# EasyEDA Pro project 二版平衡车pcb.epro, board PCB_PCB_STM32F1-HC05-board_2024-06-19
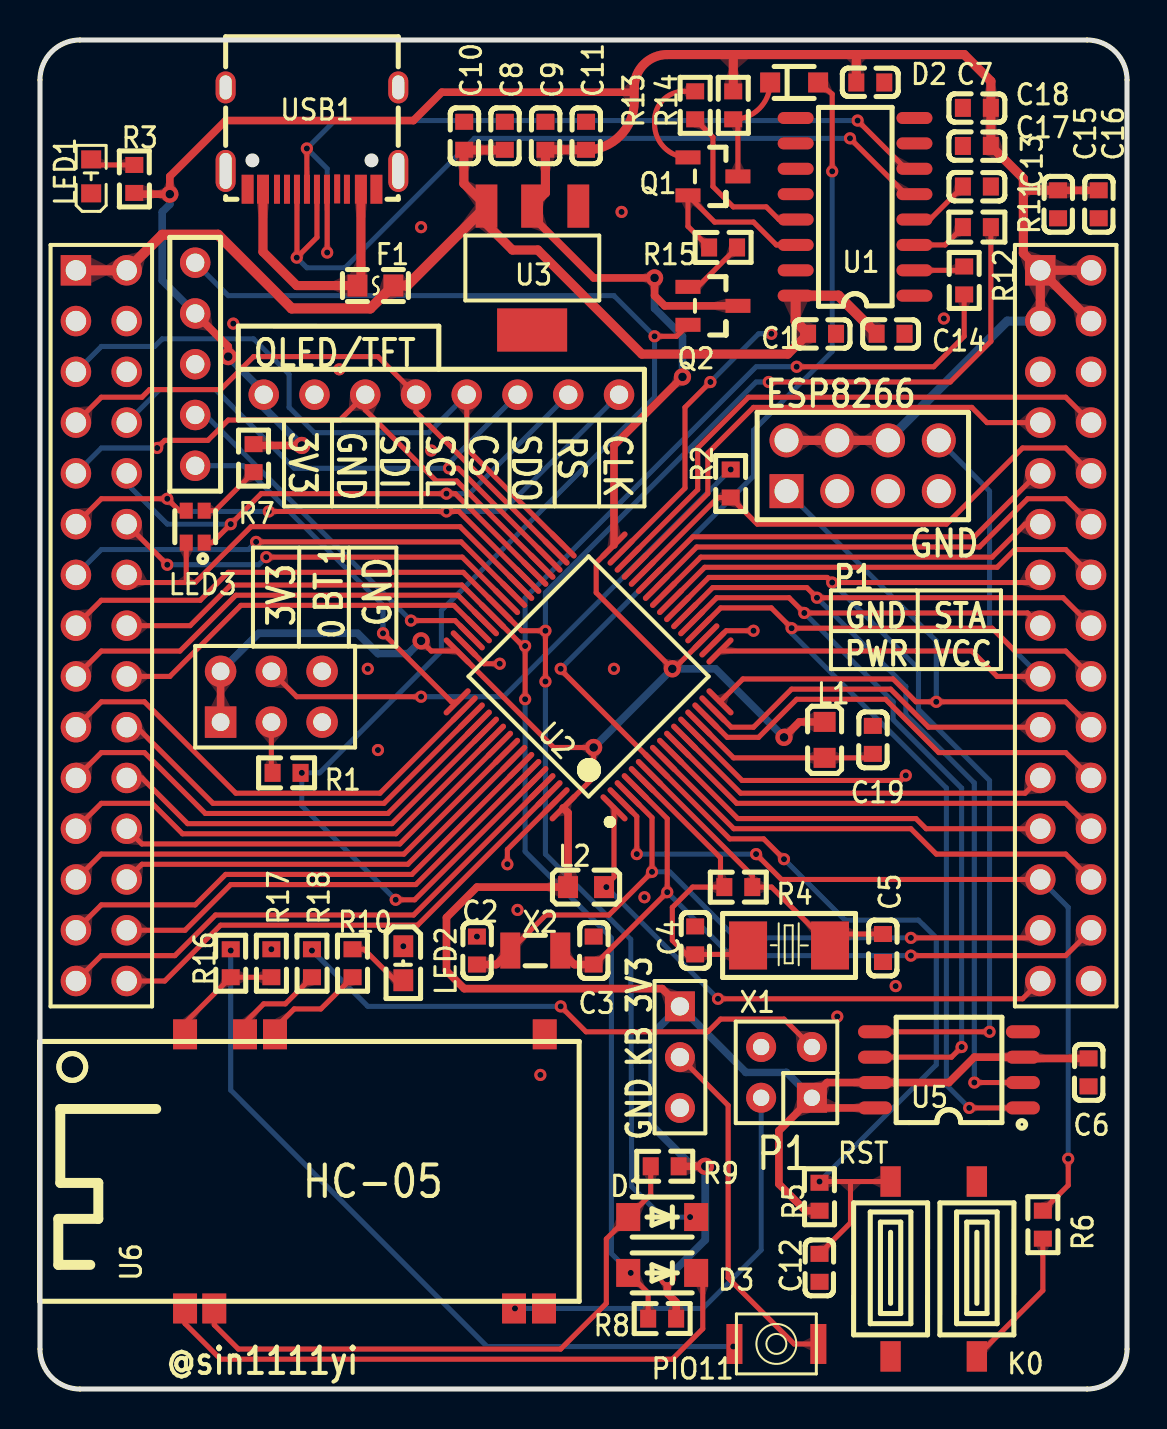
[diagram p10: board, top side]
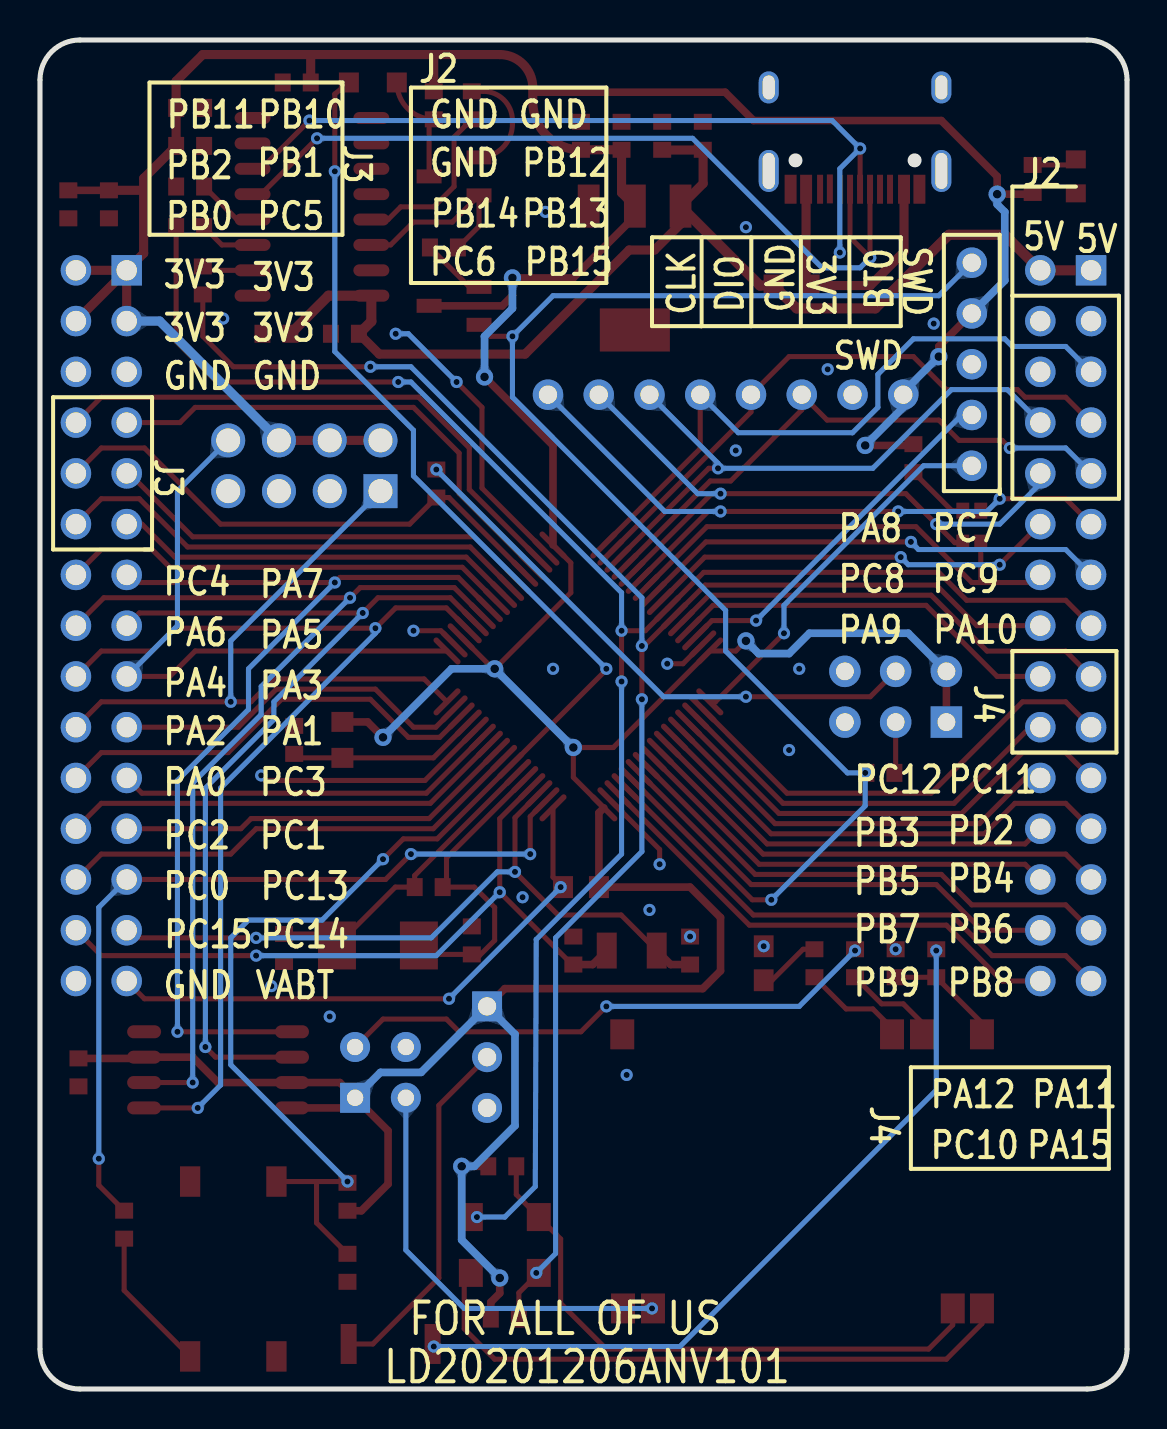
[diagram p11: board, bottom side, seen from below]

Outline 54.4 x 67.5 mm; copper layers: Top Layer, Bottom Layer. Coordinates in mm from the lower left corner of the outline.
Outline path: 0,65.5 0,2 arc(0.59,0.59) 2,0 52.4,0 arc(53.81,0.59) 54.4,2 54.4,65.5 arc(53.81,66.91) 52.4,67.5 2,67.5 arc(0.59,66.91) 0,65.5
Stack: Top Layer 0.035mm / Dielectric1 1.51mm FR4 er 4.5 / Bottom Layer 0.035mm

## Design rules (mm)
spacing Default (default): track to track 0.152, other pairs 0 to 0.152
track width Default (default): min 0.254, default 0.254, max 25.4
differential pair differentialPair (default): width min 0.127, default 0.254, max 2.54; gap min 0.152, default 0.152
via Default (default): diameter min 0.61, default 0.61, max 100.025; hole min 0.305, default 0.305, max 59.995
net GND uses gge23379
pour e256 uses gge23398
pour e1256 uses gge23379

## Placement (name value [footprint] x y rotation side)
1  -  [HEADER5*1]  7.77 51.28 270 top
C1  10uF  [C0603]  39.14 52.8 180 top
C2  12pF  [C0603]  21.87 21.94 270 top
C3  12pF  [C0603]  27.71 21.94 270 top
C4  22pF  [C0603]  32.79 22.45 270 top
C5  22pF  [C0603]  42.19 22.07 90 top
C6  100nF  [C0603]  52.47 15.84 270 top
C7  100nF  [C0603]  41.55 65.37 0 top
C8  10uF  [C0603]  23.26 62.71 270 top
C9  10uF  [C0603]  25.3 62.71 270 top
C10  100nF  [C0603]  21.23 62.71 270 top
C11  100nF  [C0603]  27.33 62.71 270 top
C12  10uF  [C0603]  39.01 6.06 90 top
C13  1nF  [C0603]  46.89 60.17 180 top
C14  100nF  [C0603]  42.57 52.8 180 top
C15  100nF  [C0603]  50.95 59.28 270 top
C16  100nF  [C0603]  52.98 59.28 270 top
C17  100nF  [C0603]  46.89 62.2 180 top
C18  100nF  [C0603]  46.89 64.1 180 top
C19  100nF  [C0603]  41.68 32.48 270 top
D1  MBR0540T1G  [SOD-123_L2.8-W1.8-LS3.7-RD]  31.14 8.6 180 top
D2  1N4148WS T4  [SOD-323_L1.8-W1.3-LS2.5-RD]  37.74 65.37 0 top
D3  MBR0540T1G  [SOD-123_L2.8-W1.8-LS3.7-RD]  31.14 5.81 180 top
F1  ASMD0603-050  [F0603]  16.79 55.21 0 top
H1  2.54排母2.54_2x3  [HDR-3X2/2.54]  11.58 34.64 0 top
H2  Header2*4  [HEADER2*4_2.54MM]  41.17 46.2 0 top
J2  Header-Male-2.54_2x15  [HDR-TH_30P-P2.54-V-R2-C15-S2.54]  51.33 38.19 270 top
J3  Header-Male-2.54_2x15  [HDR-TH_30P-P2.54-V-R2-C15-S2.54]  3.07 38.19 270 top
J4  HEADER1*3  [HDR1X3]  32.03 16.6 270 top
K0  SWITCH-3x6x2.5_SMD  [SWITCH-3X6X2.5_SMD]  46.89 10.38 0 top
L1  SCBG160808U070T  [L0603]  39.27 32.48 270 top
L2  SCBG160808U070T  [L0603]  27.33 25.11 180 top
LED1  FC-D1608WD-460H5  [LED0603-RD]  2.56 60.67 90 top
LED2  19-217/BHC-ZL1M2RY/3T  [LED0603-R-RD]  18.18 21.3 270 top
LED3  19-237/R6GHBHC-M07/2T  [LED-ARRAY-SMD_4P-L1.6-W1.6-TR]  7.77 43.15 270 top
P1  Header 2*2  [LC-HDR2*2-2.54]  37.36 15.84 90 top
PIO11  SKRKAEE020 轻触开关3*4*2  [SKRKAEE020]  36.85 2.25 0 top
Q1  S9013 J3  [SOT-23-3_L2.9-W1.3-P1.90-LS2.4-BR]  33.68 60.67 180 top
Q2  S9013 J3  [SOT-23-3_L2.9-W1.3-P1.90-LS2.4-BR]  33.68 54.2 180 top
R1  10K  [R0603]  12.34 30.83 0 top
R2  10K  [R0603]  34.57 45.31 90 top
R3  1.21K  [R0603]  4.72 60.55 270 top
R4  1M  [R0603]  34.95 25.11 180 top
R5  10K  [R0603]  39.01 9.62 90 top
R6  10K  [R0603]  50.19 8.22 270 top
R7  510  [R0603]  10.69 46.58 90 top
R8  5.6K  [R0603]  31.14 3.52 0 top
R9  5.6K  [R0603]  31.26 11.14 0 top
R10  510  [R0603]  15.64 21.3 90 top
R11  10K  [R0603]  46.89 58.13 0 top
R12  10K  [R0603]  46.25 55.47 270 top
R13  10K  [R0603]  32.79 64.23 270 top
R14  10K  [R0603]  34.69 64.23 270 top
R15  10K  [R0603]  34.18 57.12 0 top
R16  510  [R0603]  9.55 21.3 90 top
R17  10K  [R0603]  11.58 21.3 270 top
R18  10K  [R0603]  13.61 21.3 270 top
RST  SWITCH-3x6x2.5_SMD  [SWITCH-3X6X2.5_SMD]  42.57 10.38 0 top
U1  CH340G  [SOIC-16_L9.9-W3.9-P1.27-LS6.0-BR]  40.79 59.15 0 top
U2  STM32F103RCT6  [LQFP-64_L10.0-W10.0-P0.50-LS12.0-BL]  27.45 35.65 45 top
U3  AMS1117-3.3_C165482  [SOT-223_L6.5-W3.5-P2.30-LS7.0-BR]  24.64 56.09 90 top
U4  Header8P  [排针8P]  11.2 49.75 0 top
U5  W25Q80DVSSIG  [SOIC-8_L5.3-W5.3-P1.27-LS8.0-BL]  45.49 15.97 90 top
U6  HC-05  [BTK-05]  13.48 10.89 90 top
USB1  TYPEC-304-BCP16  [USB-C-SMD_TYPEC-304-BCP16]  13.61 62.58 180 top
X1  8MHz  [OSC-SMD_L5.0-W3.2]  37.49 22.19 180 top
X2  32.768KHz  [FC-135R_L3.2-W1.5]  24.79 21.94 180 top

## Footprints (pads in the part's own frame, mm; a bottom-side part is the same pattern mirrored in y, then rotated)
BTK-05
  rect 1.5x1.2 smd: 1(-6.858,6.223) 2(-6.858,4.761) 12(-6.858,-10.239) 13(-6.858,-11.739) 22(6.858,-11.777) 31(6.858,1.723) 32(6.858,3.223) 34(6.858,6.223)
C0603
  rect 0.8x0.9 smd: 1(-0.7,0) 2(0.7,0)
F0603
  rect 1x1.1 smd: 1(-0.9,0) 2(0.9,0)
FC-135R_L3.2-W1.5
  rect 1x1.8 smd: 1(-1.25,0) 2(1.25,0)
HDR1X3
  rect 1.498x1.498 hole 0.914: 1(-2.54,0)
  round 1.498 hole 0.914: 2(0,0) 3(2.54,0)
HDR-3X2/2.54
  rect 1.575x1.575 hole 0.889: 1(-2.54,-1.27)
  round 1.575 hole 0.889: 2(-2.54,1.27) 3(0,-1.27) 4(0,1.27) 5(2.54,-1.27) 6(2.54,1.27)
HDR-TH_30P-P2.54-V-R2-C15-S2.54
  rect 1.524x1.524 hole 1.016x1.021: 1(-17.78,-1.27)
  round 1.524 hole 1.021x1.016: 2(-17.78,1.27) 3(-15.24,-1.27) 4(-15.24,1.27) 5(-12.7,-1.27) 6(-12.7,1.27) 7(-10.16,-1.27) 8(-10.16,1.27) 9(-7.62,-1.27) 10(-7.62,1.27) 11(-5.08,-1.27) 12(-5.08,1.27) 13(-2.54,-1.27) 14(-2.54,1.27) 15(0,-1.27) 16(0,1.27) 17(2.54,-1.27) 18(2.54,1.27) 19(5.08,-1.27) 20(5.08,1.27) 21(7.62,-1.27) 22(7.62,1.27) 23(10.16,-1.27) 24(10.16,1.27) 25(12.7,-1.27) 26(12.7,1.27) 27(15.24,-1.27) 28(15.24,1.27) 29(17.78,-1.27) 30(17.78,1.27)
HEADER2*4_2.54MM
  rect 1.7x1.7 hole 1.2: 1(-3.81,-1.27)
  round 1.7 hole 1.2: 2(-3.81,1.27) 3(-1.27,-1.27) 4(-1.27,1.27) 5(1.27,-1.27) 6(1.27,1.27) 7(3.81,-1.27) 8(3.81,1.27)
HEADER5*1
  round 1.524 hole 0.914: 1(-5.08,0) 2(-2.54,0) 3(0,0) 4(2.54,0) 5(5.08,0)
L0603
  rect 1x1.1 smd: 1(-0.9,0) 2(0.9,0)
LC-HDR2*2-2.54
  rect 1.5x1.5 hole 0.818x0.813: 1(-1.27,-1.27)
  round 1.5 hole 0.818x0.813: 2(-1.27,1.27) 3(1.27,-1.27) 4(1.27,1.27)
LED0603-R-RD
  rect 1.092x0.991 smd: 1(0.851,0) 2(-0.851,0)
LED0603-RD
  rect 0.9x1 smd: 1(-0.85,0) 2(0.85,0)
LED-ARRAY-SMD_4P-L1.6-W1.6-TR
  rect 0.8x0.65 smd: 1(0.8,0.45) 2(-0.8,0.45) 3(-0.8,-0.45) 4(0.8,-0.45)
LQFP-64_L10.0-W10.0-P0.50-LS12.0-BL
  oval 0.28x1.8 smd: 1(-3.75,-5.55) 2(-3.25,-5.55) 3(-2.75,-5.55) 4(-2.25,-5.55) 5(-1.75,-5.55) 6(-1.25,-5.55) 7(-0.75,-5.55) 8(-0.25,-5.55) 9(0.25,-5.55) 10(0.75,-5.55) 11(1.25,-5.55) 12(1.75,-5.55) 13(2.25,-5.55) 14(2.75,-5.55) 15(3.25,-5.55) 16(3.75,-5.55) 33(3.75,5.55) 34(3.25,5.55) 35(2.75,5.55) 36(2.25,5.55) 37(1.75,5.55) 38(1.25,5.55) 39(0.75,5.55) 40(0.25,5.55) 41(-0.25,5.55) 42(-0.75,5.55) 43(-1.25,5.55) 44(-1.75,5.55) 45(-2.25,5.55) 46(-2.75,5.55) 47(-3.25,5.55) 48(-3.75,5.55)
  oval 1.8x0.28 smd: 17(5.55,-3.75) 18(5.55,-3.25) 19(5.55,-2.75) 20(5.55,-2.25) 21(5.55,-1.75) 22(5.55,-1.25) 23(5.55,-0.75) 24(5.55,-0.25) 25(5.55,0.25) 26(5.55,0.75) 27(5.55,1.25) 28(5.55,1.75) 29(5.55,2.25) 30(5.55,2.75) 31(5.55,3.25) 32(5.55,3.75) 49(-5.55,3.75) 50(-5.55,3.25) 51(-5.55,2.75) 52(-5.55,2.25) 53(-5.55,1.75) 54(-5.55,1.25) 55(-5.55,0.75) 56(-5.55,0.25) 57(-5.55,-0.25) 58(-5.55,-0.75) 59(-5.55,-1.25) 60(-5.55,-1.75) 61(-5.55,-2.25) 62(-5.55,-2.75) 63(-5.55,-3.25) 64(-5.55,-3.75)
OSC-SMD_L5.0-W3.2
  rect 1.9x2.4 smd: 1(-2.05,0) 2(2.05,0)
R0603
  rect 0.8x0.9 smd: 1(-0.7,0) 2(0.7,0)
SKRKAEE020
  rect 0.8x2 smd: 1(-2.1,0) 2(2.1,0)
SOD-123_L2.8-W1.8-LS3.7-RD
  rect 1.2x1.4 smd: 1(-1.7,0) 2(1.7,0)
SOD-323_L1.8-W1.3-LS2.5-RD
  rect 1x1 smd: 1(-1.2,0) 2(1.2,0)
SOIC-8_L5.3-W5.3-P1.27-LS8.0-BL
  oval 0.65x1.7 smd: 1(-1.905,-3.7) 2(-0.635,-3.7) 3(0.635,-3.7) 4(1.905,-3.7) 5(1.905,3.7) 6(0.635,3.7) 7(-0.635,3.7) 8(-1.905,3.7)
SOIC-16_L9.9-W3.9-P1.27-LS6.0-BR
  oval 1.8x0.6 smd: 1(2.972,-4.445) 2(2.972,-3.175) 3(2.972,-1.905) 4(2.972,-0.635) 5(2.972,0.635) 6(2.972,1.905) 7(2.972,3.175) 8(2.972,4.445) 9(-2.972,4.445) 10(-2.972,3.175) 11(-2.972,1.905) 12(-2.972,0.635) 13(-2.972,-0.635) 14(-2.972,-1.905) 15(-2.972,-3.175) 16(-2.972,-4.445)
SOT-23-3_L2.9-W1.3-P1.90-LS2.4-BR
  rect 1.25x0.7 smd: 1(1.25,-0.95) 2(1.25,0.95) 3(-1.25,0)
SOT-223_L6.5-W3.5-P2.30-LS7.0-BR
  rect 2.159x1.092 smd: 1(3.099,-2.299) 2(3.099,0.013) 3(3.099,2.299)
  rect 2.159x3.505 smd: 4(-3.099,0.013)
SWITCH-3X6X2.5_SMD
  rect 1.016x1.524 smd: 1(0,0) 2(0,-8.75)
USB-C-SMD_TYPEC-304-BCP16
  oval 1x2.1 hole 0.6x1.8: 13(-4.32,1.633) 14(4.32,1.633)
  oval 1x1.6 hole 0.6x1.2: 15(-4.32,-2.547) 16(4.32,-2.547)
  rect 0.6x1.45 smd: A1B12(-3.225,2.547) A4B9(-2.45,2.547) B1A12(3.22,2.547) B4A9(2.45,2.547)
  rect 0.3x1.45 smd: A5(-1.26,2.533) A6(-0.25,2.547) A7(0.25,2.547) A8(1.25,2.547) B5(1.75,2.547) B6(0.75,2.547) B7(-0.75,2.547) B8(-1.75,2.547)
排针8P
  round 1.524 hole 0.914: 1(0,0) 2(2.54,0) 3(5.08,0) 4(7.62,0) 5(10.16,0) 6(12.7,0) 7(15.24,0) 8(17.78,0)

## Nets
+5V: C1.2 C8.2 C10.2 C14.2 F1.2 J3.1 J3.2 U1.16 U3.3
GND: 1.3 C1.1 C2.1 C3.1 C4.1 C5.1 C6.2 C7.2 C8.1 C9.1 C10.1 C11.1 C12.1 C13.1 C14.1 C15.2 C16.2 C17.2 C18.2 C19.1 H1.5 H1.6 H2.7 J2.5 J2.6 J2.30 J3.3 J3.4 J3.6 J4.3 K0.1 LED1.1 LED2.2 P1.4 R17.1 RST.2 U1.1 U2.12 U2.18 U2.31 U2.47 U2.63 U3.1 U4.2 U5.4 U6.13 U6.22 USB1.A1B12 USB1.B1A12
VCC: 1.2 C6.1 C7.1 C9.2 C11.2 C15.1 C16.1 C17.1 C18.1 H1.1 H1.2 H2.2 H2.4 H2.6 J2.1 J2.2 J2.3 J2.4 J4.1 L1.1 L2.2 P1.1 Q2.3 R3.2 R5.1 R7.2 R8.2 R9.2 R14.1 U2.19 U2.32 U2.48 U2.64 U3.2 U4.1 U5.3 U5.7 U5.8
VDDA: C19.2 L1.2 U2.13
BLE_VCC: P1.2 U6.12
BOOT0: 1.1 Q2.2 R1.2 U2.60
CH340_D+: U1.5 USB1.A6 USB1.B6
CH340_D-: U1.6 USB1.A7 USB1.B7
H1_3: H1.3 R1.1
H1_4: H1.4 R2.2
HC05_RX: D1.2 R9.1 U6.2
HC05_TX: D3.1 U6.1
LED1_2: LED1.2 R3.1
LED3_2: LED3.2 R7.1
NRST: C12.2 D2.2 R5.2 RST.1 U2.7
OSC32_IN: C2.2 J2.27 U2.3 X2.2
OSC32_OUT: C3.2 J2.28 U2.4 X2.1
OSC_IN: C4.2 R4.2 U2.5 X1.2
OSC_OUT: C5.2 R4.1 U2.6 X1.1
PA0: J2.22 U2.14
PA1: J2.19 U2.15
PA2: H2.1 J2.20 U2.16
PA3: H2.8 J2.17 U2.17
PA4: J2.18 U2.20 U5.1
PA5: J2.15 U2.21 U5.6
PA6: J2.16 U2.22 U5.2
PA7: J2.13 U2.23 U5.5
PA8: J3.12 U2.41
PA9: D1.1 J3.15 R11.2 U2.42
PA10: D3.2 J3.16 R8.1 R12.2 U2.43
PA11: J3.17 U2.44
PA12: J3.18 U2.45
PA13: 1.4 U2.46
PA14: 1.5 U2.49
PA15: J3.19 U2.50
PB0: J2.12 U2.26
PB1: J2.9 U2.27
PB2: J2.10 R2.1 U2.28
PB3: J3.24 U2.55
PB4: J3.25 U2.56
PB5: J3.26 U2.57
PB6: J3.27 U2.58
PB7: J3.28 U2.59
PB8: J3.29 U2.61
PB9: J3.30 U2.62
PB10: J2.7 U2.29
PB11: J2.8 U2.30
PB12: J3.5 U2.33 U4.5
PB13: J3.7 U2.34 U4.4
PB14: J3.8 U2.35 U4.6
PB15: J3.9 U2.36 U4.3
PC0: J2.26 U2.8
PC1: J2.23 U2.9
PC2: J2.24 U2.10
PC3: J2.21 U2.11
PC4: J2.14 U2.24
PC5: J2.11 U2.25
PC6: J3.10 LED3.1 U2.37 U4.7
PC7: J3.11 LED3.3 U2.38 U4.8
PC8: J3.14 LED3.4 U2.39
PC9: J3.13 U2.40
PC10: J3.20 U2.51
PC11: J3.21 U2.52
PC12: J3.22 U2.53
PC13: J2.25 R6.1 U2.2
PD2: J3.23 U2.54
PIO11_2: J4.2 PIO11.2
R6_2: K0.2 R6.2
R10_2: LED2.1 R10.2
R13_1: Q1.1 R13.1
R14_2: D2.1 Q1.3 R14.2
R15_2: Q2.1 R15.2
R16_2: PIO11.1 R16.2
STATE: P1.3 R18.1
U1_2: R12.1 U1.2
U1_3: R11.1 U1.3
U1_4: C13.2 U1.4
U1_13: R13.2 U1.13
U1_14: Q1.2 R15.1 U1.14
U6_31: R10.1 U6.31
U6_32: R18.2 U6.32
U6_34: R16.1 R17.2 U6.34
USB1_B4A9: F1.1 USB1.A4B9 USB1.B4A9
VABT: J2.29 L2.1 U2.1

Pads without a net: H2 3 5; U1 7 8 9 10 11 12 15; U3 4; USB1 13 14 15 16 A5 A8 B5 B8

## Via types
v1: diameter 0.61, hole 0.305, Top Layer to Bottom Layer, 80 vias
v2: diameter 0.864, hole 0.432, Top Layer to Bottom Layer, 11 vias

## Routing (per net, layer and track width the routed paths; a pad name or vN(x,y) marks a point on that pad's centre or on a via; arc(x,y) is an arc through that point)
+5V: length 57.3
  Top Layer w0.457: 38.44,52.8 37.42,51.78 30.12,51.78 24.91,56.99 23.64,56.99 22.34,58.29 22.34,59.19 21.21,60.32 21.21,61.99 23.25,61.99
  Top Layer w0.508: 38.44,52.8 37.82,53.42 U1.16 39.96,54.7 C14.2 ; 22.34,59.19 18.37,55.21 17.68,55.21 16.53,54.07 12.59,54.07 8.91,57.75 6.12,57.75 J3.2 J3.1
GND: length 35
  Top Layer w0.254: v1(33.55,50.39) 32.28,49.12 32.28,45.08 29.08,41.88 ; U2.12 35.14,30.45 43.08,30.45 v1(43.33,30.7) ; 21.23,37.28 22.22,36.29 v1(23.01,36.29) ; 33.68,37.28 34.34,37.94 v1(35.71,37.94) ; v1(23.39,26.26) 23.39,27 25.83,29.43
  Bottom Layer w0.254: v1(33.55,50.39) 35.96,52.8 v1(36.6,52.8)
  vias: v1(9.67,53.31) v1(11.58,22) v1(14.98,51.02) v1(16.4,36.04) v1(16.91,31.97) v1(18.18,22.15) v1(19.07,58.13) v1(19.58,46.96) v1(21.87,22.64) v1(23.9,23.97) v1(25.04,15.72) v1(28.72,36.04) v1(29.11,58.9) v1(30.25,24.61) v1(39.9,18.64) v1(42.82,20.16) v1(45.23,53.56)
VCC: length 278.9
  Top Layer w0.254: v2(19.07,37.43) 19.58,36.93 20.88,36.93 25.71,32.1 v2(27.71,32.1) 27.71,30.61 26.18,29.08 ; U2.19 31.72,36.04 v2(31.64,36.04) 27.84,39.85 27.84,41.34 U2.32
  Top Layer w0.381: v2(32.15,50.64) 28.73,47.21 U2.32 ; v2(9.42,51.66) 9.42,52.17 1.2 ; 41.66,15.34 45.49,15.34 46.76,16.61 49.19,16.61 ; v2(13.1,47.21) 10.76,47.21 10.69,47.28 ; R5.1 38.32,8.92 36.98,10.26 36.98,12.92 P1.1 ; 26.18,29.08 26.43,28.83 L2.2 21.87,25.11 20.34,23.59 20.34,20.92 21.23,20.03 31.14,20.03 J4.1 ; H1.2 9.04,33.37 ; R3.2 4.78,59.79 v2(6.5,59.78) 6.5,60.67 9.29,63.47 18.69,63.47 20.11,64.89 29.74,64.89 ; P1.1 39.39,15.34 41.79,15.34 ; P1.1 39.14,14.07 U5.8 ; 31.84,3.52 31.84,4.35 31.39,4.79 v2(31.39,5.56) ; 31.97,11.14 v2(33.3,11.14) ; 49.06,16.61 49.19,16.61 ; 49.19,16.61 49.25,16.54 52.47,16.54 ; 24.63,59.19 24.63,58.67 27.71,55.59 v2(30.76,55.59) 30.76,54.71 31.26,54.2 Q2.3 ; 50.95,59.98 52.98,59.98 ; v2(37.23,32.61) 38.01,33.38 L1.1
  Top Layer w0.457: 27.31,61.99 arc(29.03,62.7) 29.74,64.42 29.74,65.12 arc(30.22,66.29) 31.39,66.77 46.25,66.77 47.59,65.44 47.59,62.2 49.21,60.57 49.21,56.82 J2.1 ; H2.2 H2.4 42.44,47.47 ; J2.1 52.6,53.44 ; J2.1 J2.3 ; J2.1 52.6,55.98 ; 49.21,60.02 49.25,59.98 50.95,59.98 ; 24.63,59.19 25.3,59.85 25.3,62.01 27.33,62.01 ; 40.84,66.77 40.85,66.76 40.85,65.37 ; 34.69,64.93 34.7,66.77
  Bottom Layer w0.381: v2(30.76,55.59) 30.76,54.07 32.15,52.67 v2(32.15,50.64) ; v2(6.5,59.78) 6.5,59.28 6.12,58.9 6.12,55.47 1.2 ; v2(19.07,37.43) 18.44,36.8 16.91,36.8 15.9,37.81 10.94,37.81 H1.2 ; v2(13.1,47.21) 11.2,49.12 U4.1 11.2,49.88 v2(9.42,51.66) ; P1.1 37.36,15.84 35.33,15.84 J4.1 30.63,17.75 30.63,13.18 32.66,11.14 v2(33.3,11.14) 33.3,7.46 v2(31.39,5.56) ; v2(37.23,32.61) 33.8,36.04 v2(31.64,36.04) v2(27.71,32.1)
  Bottom Layer w0.457: J2.3 48.41,53.44 42.44,47.47
VDDA: length 9.5
  Top Layer w0.254: 32.97,33.32 34.71,31.58 L1.2 41.48,31.58 C19.2
BLE_VCC: length 21.1
  Bottom Layer w0.254: P1.2 36.09,6.95 33.17,4.03 v1(23.77,4.03)
BOOT0: length 73.9
  Top Layer w0.254: v1(30.76,52.67) 31.85,52.67 Q2.2 ; v1(17.8,24.48) 18.75,24.48 U2.60
  Bottom Layer w0.254: 1.1 9.42,54.7 28.72,54.7 v1(30.76,52.67) 30.76,49.62 20.09,38.96 20.09,36.92 13.99,30.83 v1(13.1,30.83) 13.1,29.18 v1(17.8,24.48)
CH340_D+: length 42.2
  Top Layer w0.254: v1(40.53,62.58) 43.33,59.78 43.76,59.78 ; USB1.B6 12.86,56.62 v1(12.85,56.61) 13.86,57.62 13.86,60.03
  Bottom Layer w0.254: v1(40.53,62.58) 21.74,62.58 15.26,56.1 13.36,56.1 v1(12.85,56.61)
CH340_D-: length 43.2
  Top Layer w0.254: v1(14.37,56.86) 14.37,60.02 USB1.B7 ; v1(13.36,62.07) 13.36,60.04 13.36,60.03 ; U1.6 43.33,61.05 v1(40.92,63.47)
  Bottom Layer w0.254: 40.53,63.47 v1(40.92,63.47) 14.75,63.47 v1(13.36,62.07) 14.37,61.05 v1(14.37,56.86)
H1_3: length 2.6
  Top Layer w0.254: 11.58,33.37 11.58,30.89 11.64,30.83
H1_4: length 28.2
  Top Layer w0.254: v1(19.07,34.64) 12.85,34.64 H1.4
  Bottom Layer w0.254: v1(19.07,34.64) 23.2,34.64 v1(34.57,46.01)
HC05_RX: length 29.7
  Top Layer w0.254: R9.1 30.56,9.73 29.44,8.6 28.34,7.51 28.34,4.29 26.06,2 9.93,2 8.72,3.2 U6.2
HC05_TX: length 31
  Top Layer w0.254: 32.84,5.81 33.17,5.48 33.17,3.02 31.64,1.49 9.04,1.49 7.26,3.27 U6.1
LED1_2: length 2.3
  Top Layer w0.254: R3.1 2.84,61.25 LED1.2
LED3_2: length 3.3
  Top Layer w0.254: R7.1 8.76,43.95 LED3.2
NRST: length 82.1
  Top Layer w0.254: RST.1 39.07,10.38 R5.2 ; v1(26.06,36.04) 26.06,35.99 30.85,31.2 34.52,27.53 36.22,27.53 v1(37.23,26.51) ; v1(39.65,60.93) 39.65,64.79 38.94,65.37 ; 39.01,6.76 40.56,8.31 40.56,10.32
  Bottom Layer w0.254: v1(39.01,10.38) 44.85,16.22 44.85,22.57 43.96,23.46 40.28,23.46 v1(37.23,26.51) ; v1(26.06,36.04) 35.71,45.69 35.71,47.97 39.65,51.91 v1(39.65,60.93)
OSC32_IN: length 36
  Top Layer w0.254: J2.27 49.68,22.57 v1(43.58,22.57) ; 29.43,29.78 30.63,28.59 v1(30.63,25.88) 28.47,23.72 25.32,23.72 X2.2
  Top Layer w0.381: X2.2 22.84,21.24 21.87,21.24
  Bottom Layer w0.254: v1(30.63,25.88) 31.52,25.88 34.82,22.57 v1(43.58,22.57)
OSC32_OUT: length 36.1
  Top Layer w0.254: U2.4 31.39,28.54 v1(31.39,24.86) 27.77,21.24 27.71,21.24 ; v1(43.58,21.68) 51.33,21.68 52.6,22.95
  Top Layer w0.381: 27.71,21.24 26.74,21.24 X2.1
  Bottom Layer w0.254: v1(31.39,24.86) 34.57,21.68 v1(43.58,21.68)
OSC_IN: length 16
  Top Layer w0.254: X1.2 34.99,21.75 32.79,21.75 32.73,21.68 32.41,21.68 31.64,22.45 31.64,24.1 32.66,25.11 R4.2 ; 34.06,25.11 34.06,26.58 U2.5
OSC_OUT: length 15.9
  Top Layer w0.254: 30.49,30.85 35.65,25.69 R4.1 36.62,25.11 X1.1 40.11,22.77 42.19,22.77
PA0: length 22.1
  Top Layer w0.254: 52.6,30.57 51.33,31.84 44.98,31.84 42.31,34.51 37.87,34.51 35.96,32.61 34.39,32.61 U2.14
PA1: length 18.3
  Top Layer w0.254: 33.68,34.03 34.59,33.11 35.71,33.11 37.61,35.02 42.57,35.02 44.47,33.11 J2.19
PA2: length 33.7
  Top Layer w0.254: 52.6,33.11 51.33,34.38 43.84,34.38 42.69,35.53 35.18,35.53 U2.16
  Bottom Layer w0.254: H2.1 44.85,37.43 v1(44.85,34.38)
PA3: length 30.5
  Top Layer w0.254: U2.17 46.63,36.93 47.9,35.65 J2.17
  Bottom Layer w0.254: H2.8 47.52,44.93 47.52,38.19 J2.17
PA4: length 51.9
  Top Layer w0.254: U2.20 34.07,39.08 36.6,39.08 v1(37.61,38.07) 47.65,38.07 48.79,36.92 51.33,36.92 52.6,35.65 ; v1(46.5,14.06) 49.19,14.06
  Bottom Layer w0.254: v1(46.5,14.06) 45.36,15.21 45.36,30.07 37.61,37.81 v1(37.61,38.07)
PA5: length 48.1
  Top Layer w0.254: U5.6 45.61,16.6 v1(46.12,17.11) ; U2.21 33.86,39.59 37.49,39.59 v1(38.25,38.83) 49.42,38.83 J2.15
  Bottom Layer w0.254: v1(46.12,17.11) 46.12,30.07 42.69,33.5 42.69,34.38 v1(38.25,38.83)
PA6: length 51.7
  Top Layer w0.254: 52.6,38.19 51.2,39.59 v1(38.88,39.59) 38.38,40.1 33.67,40.1 U2.22 ; v1(46.76,15.33) 49.19,15.33
  Bottom Layer w0.254: v1(38.88,39.59) 43.33,35.15 43.33,33.75 46.76,30.32 v1(46.76,15.33)
PA7: length 50.8
  Top Layer w0.254: J2.13 50.06,40.35 v1(39.65,40.35) 39.39,40.61 33.47,40.61 31.91,39.05 ; U5.5 v1(47.52,17.87)
  Bottom Layer w0.254: v1(47.52,17.87) 47.52,30.45 43.96,34 43.96,36.04 v1(39.65,40.35)
PA8: length 20.9
  Top Layer w0.254: v1(11.33,41.62) 21.13,41.62 23.35,39.4 ; v1(6.37,41.24) J3.12
  Bottom Layer w0.254: v1(6.37,41.24) 10.94,41.24 v1(11.33,41.62)
PA9: length 94.1
  Top Layer w0.254: v1(36.47,50.39) 45.55,50.39 47.59,52.42 47.59,58.13 ; v1(25.3,35.4) v1(25.3,37.94) 24.11,37.94 23,39.05 21.18,40.86 9.42,40.86 8.02,39.46 3.07,39.46 J3.15
  Bottom Layer w0.254: v1(32.53,8.6) 31.14,8.6 29.61,10.13 29.56,22.49 25.3,26.76 v1(25.3,35.4) ; v1(25.3,37.94) 25.3,39.85 35.84,50.39 v1(36.47,50.39)
PA10: length 90.2
  Top Layer w0.254: 29.44,5.81 30.44,4.81 30.44,3.52 ; J3.16 7.52,38.19 9.55,40.23 21.11,40.23 U2.43 24.16,37.18 v1(24.28,37.18) v1(24.28,34.51) ; 46.25,54.77 46.25,52.67 44.73,51.15 v1(37.87,51.15)
  Bottom Layer w0.254: v1(24.28,34.51) 24.28,26.89 28.6,22.57 28.6,6.78 v1(29.56,5.81) ; v1(24.28,37.18) 24.28,39.59 35.84,51.15 v1(37.87,51.15)
PA11: length 22.7
  Top Layer w0.254: J3.17 3.07,36.92 7.01,36.92 9.8,39.72 20.92,39.72 U2.44
PA12: length 19.6
  Top Layer w0.254: J3.18 6.5,35.65 10.05,39.21 20.72,39.21 U2.45
PA13: length 18.4
  Top Layer w0.254: v1(18.56,38.45) 20.77,38.45 21.58,37.63
  Bottom Layer w0.254: v1(18.56,38.45) 8.28,48.74 1.4
PA14: length 18.8
  Top Layer w0.254: 20.88,34.38 20.6,34.38 v1(17.17,37.81)
  Bottom Layer w0.254: v1(17.17,37.81) 17.17,39.21 10.18,46.2 1.5
PA15: length 23.6
  Top Layer w0.254: 21.23,34.03 17.02,29.81 9.8,29.81 5.23,34.38 3.07,34.38 J3.19
PB0: length 24.1
  Top Layer w0.254: 52.6,43.27 51.33,44.54 49.42,44.54 47.01,42.13 32.87,42.13 30.85,40.11
PB1: length 21.8
  Top Layer w0.254: U2.27 32.67,42.64 46.76,42.64 49.93,45.81 J2.9
PB2: length 26.7
  Top Layer w0.254: U2.28 33.93,44.61 34.57,44.61 35.9,43.27 45.36,43.27 49.17,47.08 51.33,47.08 52.6,45.81
PB3: length 21
  Top Layer w0.254: 23,32.26 18.01,27.27 5.1,27.27 J3.24
PB4: length 24.2
  Top Layer w0.254: 23.35,31.91 18.21,26.76 3.07,26.76 J3.25
PB5: length 21.9
  Top Layer w0.254: 23.71,31.55 18.41,26.26 5.1,26.26 J3.26
PB6: length 25.7
  Top Layer w0.254: J3.27 3.07,24.22 7.77,24.22 9.29,25.75 18.61,25.75 24.06,31.2
PB7: length 23.3
  Top Layer w0.254: 24.41,30.85 18.81,25.24 9.55,25.24 7.26,22.95 J3.28
PB8: length 27.3
  Top Layer w0.254: 25.12,30.14 18.7,23.72 8.78,23.72 6.75,21.68 3.07,21.68 J3.29
PB9: length 25
  Top Layer w0.254: 25.48,29.78 18.9,23.21 9.04,23.21 6.24,20.41 J3.30
PB10: length 25.1
  Top Layer w0.254: J2.7 47.39,48.35 46.63,49.12 35.71,49.12 33.42,46.83 33.42,44.81 U2.29
PB11: length 28.3
  Top Layer w0.254: 52.6,48.35 51.33,49.62 35.45,49.62 32.92,47.08 32.92,45 U2.30
PB12: length 33.5
  Top Layer w0.254: U2.33 21.36,47.05 U4.5
  Bottom Layer w0.254: J3.5 3.07,52.16 5.74,52.16 6.12,52.55 10.69,52.55 12.47,50.77 12.47,49.12 13.74,47.85 19.45,47.85 U4.5
PB13: length 30
  Top Layer w0.254: J3.7 3.07,49.62 5.1,49.62 5.48,50.01 9.04,50.01 10.69,51.66 16.91,51.66 U4.4 18.82,48.89 25.83,41.88
PB14: length 30.4
  Top Layer w0.254: v1(20.47,46.07) 20.93,46.07 U2.35
  Bottom Layer w0.254: J3.8 5.99,50.01 8.78,50.01 12.72,46.07 v1(20.47,46.07) 20.47,46.32 U4.6
PB15: length 29
  Top Layer w0.254: 25.12,41.17 20.86,45.43 19.83,45.43 16.28,48.99 U4.3 15.01,48.48 9.42,48.48 8.4,47.47 6.24,47.47 v1(5.86,47.08)
  Bottom Layer w0.254: J3.9 3.07,47.08 v1(5.86,47.08)
PC0: length 23.9
  Top Layer w0.254: 31.2,31.55 34.72,28.03 43.58,28.03 44.85,26.76 51.33,26.76 52.6,25.49
PC1: length 20.1
  Top Layer w0.254: J2.23 44.34,28.03 43.84,28.54 34.92,28.54 U2.9
PC2: length 22.4
  Top Layer w0.254: 52.6,28.03 51.33,29.3 34.87,29.3 31.91,32.26
PC3: length 19.3
  Top Layer w0.254: U2.11 35.06,29.81 49.3,29.81 J2.21
PC4: length 22.6
  Top Layer w0.254: U2.24 33.27,41.12 47.9,41.12 48.79,42 51.33,42 52.6,40.73
PC5: length 20.3
  Top Layer w0.254: U2.25 33.07,41.62 47.65,41.62 49.3,43.27 J2.11
PC6: length 33.9
  Top Layer w0.254: LED3.1 8.62,42.35 v1(9.55,43.27) 11.07,44.8 v1(20.34,44.8) 20.78,44.8 U2.37
  Bottom Layer w0.254: v1(20.34,44.8) 21.48,44.8 U4.7 ; J3.10 4.34,45.31 6.37,43.27 v1(9.55,43.27)
PC7: length 37.1
  Top Layer w0.254: J3.11 3.07,44.54 v1(6.37,44.54) 6.97,43.95 LED3.3 ; U2.38 20.97,43.91 v1(20.34,43.91) v1(11.45,43.91)
  Bottom Layer w0.254: v1(6.37,44.54) 7.01,43.91 v1(11.45,43.91) ; U4.8 23.14,43.91 v1(20.34,43.91)
PC8: length 24.5
  Top Layer w0.254: 7.33,40.35 7.32,40.36 LED3.4 ; 24.06,40.11 21.02,43.15 10.56,43.15 7.77,40.35 4.34,40.35 J3.14
PC9: length 23.7
  Top Layer w0.254: U2.40 21.08,42.39 v1(10.82,42.39)
  Bottom Layer w0.254: v1(10.82,42.39) 10.44,42 3.07,42 J3.13
PC10: length 20.6
  Top Layer w0.254: J3.20 4.85,33.11 8.66,29.3 17.21,29.3 21.58,33.68
PC11: length 23.8
  Top Layer w0.254: 21.94,33.32 17.41,28.8 8.28,28.8 5.23,31.84 3.07,31.84 J3.21
PC12: length 20.8
  Top Layer w0.254: J3.22 5.1,30.57 7.39,28.29 17.61,28.29 U2.53
PC13: length 41.4
  Top Layer w0.254: 50.19,8.92 51.46,10.19 v1(51.46,11.52) ; v1(35.84,26.76) 37.11,25.49 J2.25 ; v1(29.87,26.76) 29.87,28.64 29.08,29.43
  Bottom Layer w0.254: J2.25 51.46,24.1 v1(51.46,11.52) ; v1(29.87,26.76) v1(35.84,26.76)
PD2: length 24
  Top Layer w0.254: U2.54 17.81,27.78 7.13,27.78 5.61,29.3 3.07,29.3 J3.23
PIO11_2: length 17.9
  Top Layer w0.254: J4.2 34.44,14.19 34.44,5.56 37.74,2.25 38.95,2.25
R6_2: length 7.3
  Top Layer w0.254: 50.19,7.52 50.19,4.93 K0.2
R10_2: length 3.2
  Top Layer w0.254: R10.2 16.21,22 17.76,20.45 LED2.1
R13_1: length 5.7
  Top Layer w0.254: 32.22,64.93 arc(31.18,64.5) 30.76,63.47 30.76,63.3 arc(31.25,62.11) Q1.1 ; 32.22,64.93 32.79,64.93
R14_2: length 5.8
  Top Layer w0.254: D2.1 arc(36,64.07) 34.7,63.53 ; Q1.3 34.93,63.3 34.69,63.53
R15_2: length 3.3
  Top Layer w0.254: 34.89,57.12 32.92,55.15 Q2.1
R16_2: length 37.7
  Top Layer w0.254: v1(9.55,21.94) 9.36,21.94 9.3,21.88
  Bottom Layer w0.254: v1(34.69,2.13) 22.37,2.13 9.55,14.95 v1(9.55,21.94)
STATE: length 27.5
  Top Layer w0.254: v1(26.06,19.14) 27.33,17.87 33.42,17.87 34.06,18.51 37.23,18.51 P1.3
  Bottom Layer w0.254: v1(13.61,21.94) 16.4,19.14 v1(26.06,19.14)
U1_2: length 2.6
  Top Layer w0.254: R12.1 46.06,55.97 U1.2
U1_3: length 2.8
  Top Layer w0.254: 46.18,58.13 45.3,57.24 U1.3
U1_4: length 3.1
  Top Layer w0.254: U1.4 44.53,58.51 46.18,60.17
U1_13: length 8.6
  Top Layer w0.254: U1.13 36.98,58.51 36.34,59.15 34.69,59.15 33.68,60.17 33.68,62.64 32.79,63.53
U1_14: length 9.5
  Top Layer w0.254: U1.14 36.85,57.24 35.71,58.39 33.76,58.39 Q1.2 32.43,58.17 33.48,57.12
U6_31: length 5.2
  Top Layer w0.254: 11.76,17.75 11.76,18.06 12.72,19.02 14.06,19.02 R10.1
U6_32: length 4.9
  Top Layer w0.254: R18.2 12.28,19.27 11.2,19.27 10.26,18.33 U6.32
U6_34: length 5.8
  Top Layer w0.254: R17.2 R16.1 7.26,18.32 U6.34
USB1_B4A9: length 13.6
  Top Layer w0.457: F1.1 16.06,55.39 16.06,60.03 ; F1.1 16.01,55.21 16.02,55.21 16.02,55.21 ; F1.1 12.85,55.21 11.16,56.9 11.16,60.03
VABT: length 28.6
  Top Layer w0.254: 28.73,29.08 28.73,25.61 L2.1 ; v1(33.93,19.53) 49.17,19.53 J2.29
  Bottom Layer w0.254: v1(33.93,19.53) v1(28.34,25.11)

## Copper pours and planes (outline as drawn; the poured copper is in the pictures)
GND on Top Layer: -0.11,68.42 -0.11,19.02 5.48,19.02 5.48,17.87 6.75,16.6 6.75,5.68 5.23,4.16 5.23,3.78 5.36,3.65 0.02,3.65 0.02,-0.67 -0.11,-0.79 54.89,-0.79 55.01,-0.67 55.01,68.17 54.76,68.42
GND on Bottom Layer: 0.02,68.42 0.02,19.02 5.48,19.02 5.48,17.75 5.61,17.75 6.75,16.6 6.75,5.68 4.72,3.65 -0.11,3.65 -0.11,-0.67 0.02,-0.79 55.01,-0.79 55.14,-0.67 55.14,68.67
VCC on Top Layer: 33.8,66.77 35.71,66.77 35.71,66.01 33.8,66.01
VCC on Top Layer: 29.11,65.77 29.87,65.77 29.87,63.86 29.11,63.86

Small or netless copper shapes (teardrops, artwork), in the pictures only: 362 on Top Layer, 103 on Bottom Layer

## Text on the board
Bottom Silkscreen Layer: J4 | SWD | 3V3 | J3 | BT0 | GND | DIO | CLK | 5V | PA11 | PA15 | J2 | PC11 | PD2 | PB4 | PB6 | PB8 | PA10 | PC7 | PC9 | PA12 | PC10 | PC12 | PB3 | PB5 | PB7 | PB9 | PA8 | PC8 | PA9 | PB15 | PB12 | PB13 | PB14 | PC6 | PC13 | PC14 | PA7 | PA5 | PA3 | PA1 | PC3 | PC1 | PB10 | PB1 | PC5 | VABT | PB11 | PB2 | PB0 | PC15 | PC4 | PA6 | PA4 | PA2 | PA0 | PC2 | PC0 | FOR ALL OF US | LD20201206ANV101
Top Silkscreen Layer: 1 | 0 | P1 | GND | PWR | STA | VCC | 3V3 | KB | @sin1111yi | OLED/TFT | ESP8266 | BT | SDI | SCL | CS | SDO | RS | CLK | HC-05
